# Altium schematic sheet MSP430_power_jtag.SchDoc: SVPXFMC Carrier 3U
size A4; CheckedBy: \; Author: G.Kasprowicz; CompanyName: ISE; DrawnBy: T.Przywozki; Organization: WUT ISE; Address1: Warsaw University of Technology; Address2: Nowowiejska 15/19 00-665 Warsaw; Revision: 1.0.; SheetNumber: 17; SheetTotal: 20; Project: SVPXFMC Carrier 3U; ModifiedBy: -; CheckedDate: -; Title2: MSP430 power and JTAG; DivGrp: ISE; Designer: G. Kasprowicz
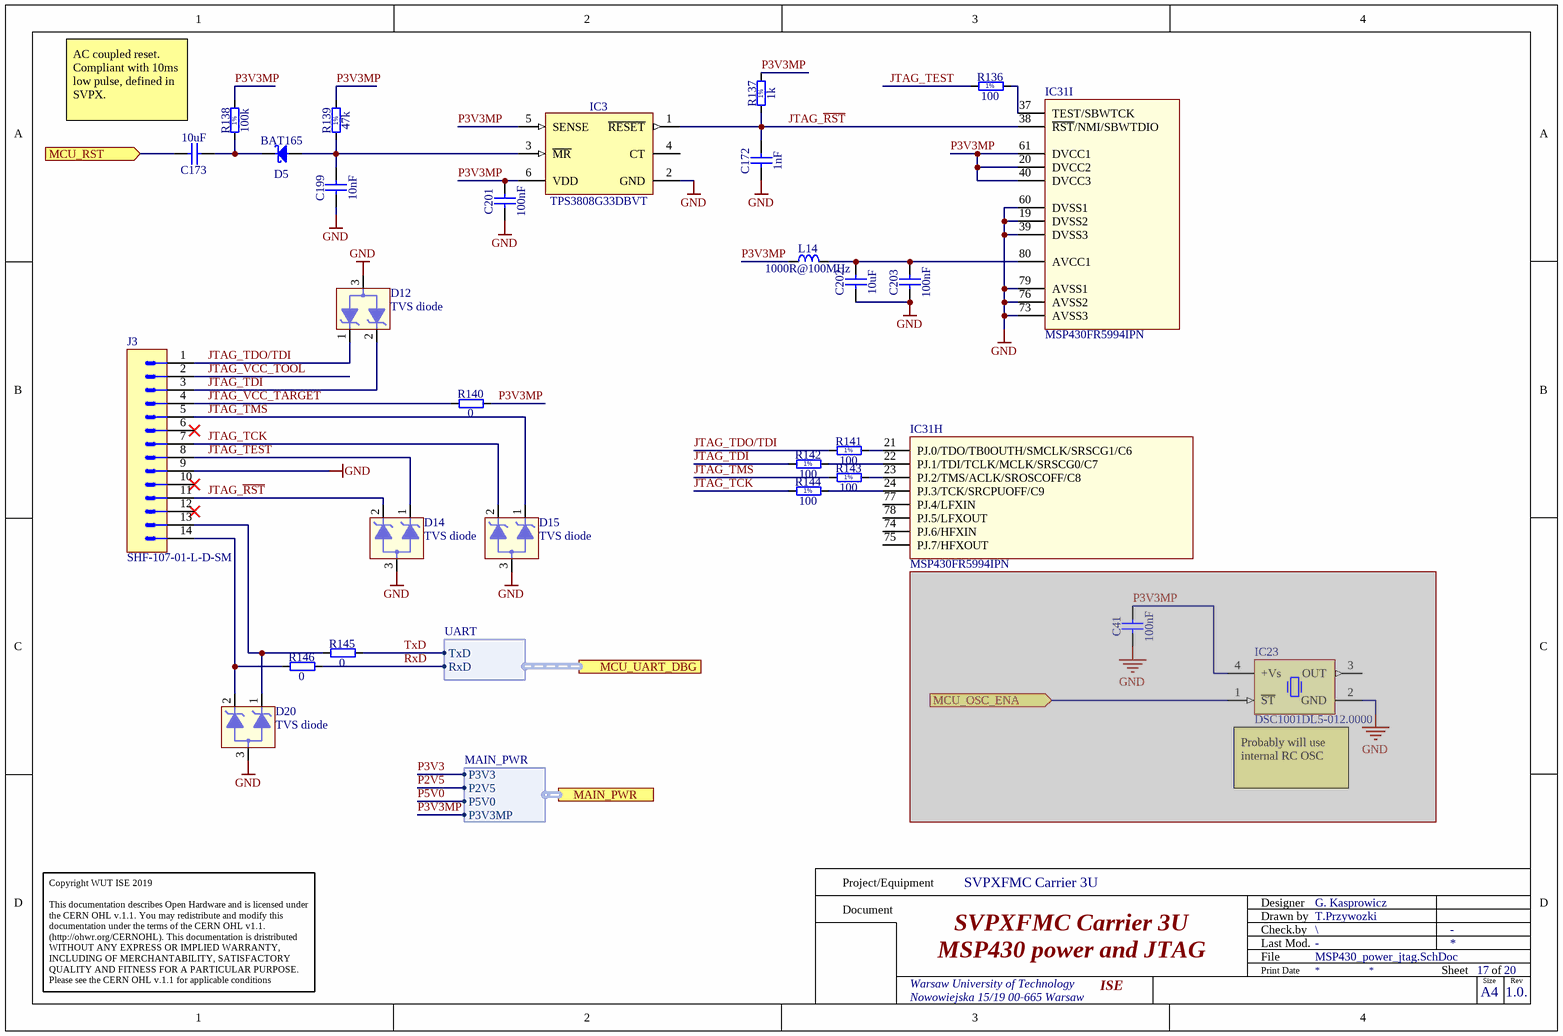
[diagram p0: MSP430_power_jtag.SchDoc]

## Parts
C41  100nF  [CAPC1005X55N]  (masked out: inside a compile mask, not in the netlist)
C172  1nF  [CAPC1005X55N]
C173  10uF  [CAPC1608X80N]
C199  10nF  [CAPC1005X55N]
C201  100nF  [CAPC1005X55N]
C202  10uF  [CAPC1608X80N]
C203  100nF  [CAPC1005X55N]
D5  BAT165  [SOD2512X110N]
D12  TVS diode  [SOTFL40P120X59-3N]
D14  TVS diode  [SOTFL40P120X59-3N]
D15  TVS diode  [SOTFL40P120X59-3N]
D20  TVS diode  [SOTFL40P120X59-3N]
IC3  TPS3808G33DBVT  [SOT95P280X145-6N]
IC23  DSC1001DL5-012.0000  [OSC_MICREL_2520]  (masked out: inside a compile mask, not in the netlist)
IC31  MSP430FR5994IPN  [QFP50P1400X1400X120-80N]  (parts H,I of 9)
J3  SHF-107-01-L-D-SM  [SHF-107-01-L-D-SM-LC]
L14  1000R@100MHz  [INDC1608X95N]
R136  100  [RESC1005X40N]
R137  1k  [RESC1005X40N]
R138  100k  [RESC1005X40N]
R139  47k  [RESC1005X40N]
R140  0  [RESC1608X55N]
R141  100  [RESC1005X40N]
R142  100  [RESC1005X40N]
R143  100  [RESC1005X40N]
R144  100  [RESC1005X40N]
R145  0  [RESC1608X55N]
R146  0  [RESC1608X55N]

## Ports
MAIN_PWR (harness MAIN_PWR), MCU_OSC_ENA (in), MCU_RST (in), MCU_UART_DBG (harness UART)

## Harnesses
UART: TxD, RxD
MAIN_PWR: P3V3, P2V5, P5V0, P3V3MP

## Nets
GND: C172.1 C199.1 C201.1 C202.1 C203.1 D12.3 D14.3 D15.3 D20.3 IC3.2(GND) IC31.19(DVSS2) IC31.39(DVSS3) IC31.60(DVSS1) IC31.73(AVSS3) IC31.76(AVSS2) IC31.79(AVSS1) J3.9
JTAG_~{RST}: C172.2 D14.2 IC3.1(~{RESET}) IC31.38(~{RST}/NMI/SBWTDIO) J3.11 R137.1
JTAG_TCK: D15.2 J3.7 R144.1
JTAG_TDI: D12.2 J3.3 R142.1
JTAG_TDO/TDI: D12.1 J3.1 R141.1
JTAG_TEST: D14.1 J3.8 R136.1
JTAG_TMS: D15.1 J3.5 R143.1
JTAG_VCC_TARGET: J3.4 R140.1
JTAG_VCC_TOOL: J3.2
MCU_RST: C173.2 ; port MCU_RST
P2V5: port MAIN_PWR.P2V5
P3V3: port MAIN_PWR.P3V3
P3V3MP: C201.2 IC3.5(SENSE) IC3.6(VDD) IC31.20(DVCC2) IC31.40(DVCC3) IC31.61(DVCC1) L14.1 R137.2 R138.2 R139.2 R140.2 ; port MAIN_PWR.P3V3MP
P5V0: port MAIN_PWR.P5V0
RxD: R146.2 ; port MCU_UART_DBG.RxD
TxD: R145.2 ; port MCU_UART_DBG.TxD
NetC173_1: C173.1 D5.1(C) R138.1
NetC199_2: C199.2 D5.2(A) IC3.3(~{MR}) R139.1
NetC202_2: C202.2 C203.2 IC31.80(AVCC1) L14.2
NetD20_1: D20.1 J3.13 R145.1
NetD20_2: D20.2 J3.14 R146.1
NetIC31_21: IC31.21(PJ.0/TDO/TB0OUTH/SMCLK/SRSCG1/C6) R141.2
NetIC31_22: IC31.22(PJ.1/TDI/TCLK/MCLK/SRSCG0/C7) R142.2
NetIC31_23: IC31.23(PJ.2/TMS/ACLK/SROSCOFF/C8) R143.2
NetIC31_24: IC31.24(PJ.3/TCK/SRCPUOFF/C9) R144.2
NetIC31_37: IC31.37(TEST/SBWTCK) R136.2

Not connected (* = marked no-connect by the designer): IC3 4(CT); IC31 74(PJ.6/HFXIN) 75(PJ.7/HFXOUT) 77(PJ.4/LFXIN) 78(PJ.5/LFXOUT); J3 6* 10* 12*

## Notes on the sheet
- AC coupled reset. Compliant with 10ms low pulse, defined in SVPX.
- (near J3) Verify JTAG connection. Documentation connects 1 pin of the connector to "TDI/TDO" pin uC.
  IO description does not contain a pin described as "TDI/TDO".
- (near IC23) Probably will use internal RC OSC
- Project/Equipment
- Document
- Designer
- Drawn by
- Check.by
- Copyright WUT ISE 2019
  This documentation describes Open Hardware and is licensed under the CERN OHL v.1.1. You may redistribute and modify this documentation under the terms of the CERN OHL v1.1.
  (http://ohwr.org/CERNOHL). This documentation is dristributed WITHOUT ANY EXPRESS OR IMPLIED WARRANTY, INCLUDING OF MERCHANTABILITY, SATISFACTORY QUALITY AND FITNESS FOR A PARTICULAR PURPOSE. Please see the CERN OHL v.1.1 for applicable conditions
- File
- Last Mod.
- Print Date
- Sheet
- Size
- A4
- of
- Rev
- (in symbol R0402_1K_1%_0.0625W_100PPM) 1%
- (in symbol R0402_47K_1%_0.0625W_100PPM) 1%
- (in symbol R0402_100K_1%_0.0625W_100PPM) 1%
- (in symbol R0402_100R_1%_0.0625W_100PPM) 1%

## Library data of the parts
C41 C201 C203 = CC0402_100NF_25V_10%_X7R_YUDEN_TMK105B7104KVHF: Non-polarised capacitor; Part Description: SMD Multilayer Chip Ceramic Capacitor (High Dielectric Type) for Automotive / Industrial Applications; Manufacturer: TAIYO YUDEN; Voltage: 25V; TC: X7R; Tolerance: ±10%; Part Number: CC0402_100NF_25V_10%_X7R_YUDEN_TMK105B7104KVHF; Component Kind: Standard; Component Type: Standard; Pin Count: 2; Value: 100nF; Status: Not Recommended; Manufacturer Part Number: TMK105B7104KVHF; Case: 0402; Mounted: Yes; Socket: No; SMD: Yes; Sense: No; HelpURL: \\cern.ch\dfs\Applications\Altium\Datasheets\CC0402_TAIYO-YUDEN_TMK105B7104KVHF.pdf; Author: CERN DEM JLC; CreateDate: 10.05.2017; LatestRevisionDate: 10.05.2017; ComponentHeight: 0.55mm
C172 = CC0402_1NF_50V_10%_X7R: Non-polarised capacitor; Part Description: SMD Multilayer Chip Ceramic Capacitor; Manufacturer: GENERIC; Manufacturer1 Part Number: 223858715623; Voltage: 50V; TC: X7R; Tolerance: ±10%; Part Number: CC0402_1NF_50V_10%_X7R; Component Kind: Standard; Component Type: Standard; Pin Count: 2; Value: 1nF; Status: Not Recommended; Manufacturer Part Number: CC0402_1NF_50V_10%_X7R; Case: 0402; Mounted: Yes; Socket: No; SMD: Yes; Sense: No; Manufacturer1 Example: PHYCOMP; Manufacturer1 ComponentHeight: 0.55mm; HelpURL: \\cern.ch\dfs\Applications\Altium\Datasheets\CC0402_X7R_PHYCOMP.pdf; Author: CERN DEM JLC; CreateDate: 03.12.2007; LatestRevisionDate: 03.12.2007
C173 C202 = CC0603_10UF_16V_20%_X5R: Non-polarised capacitor; Part Description: SMD Multilayer Chip Ceramic Capacitor; Manufacturer: GENERIC; Manufacturer1 Part Number: GRM188R61C106MA73D; Voltage: 16V; TC: X5R; Tolerance: ±20%; Part Number: CC0603_10UF_16V_20%_X5R; Component Kind: Standard; Component Type: Standard; Pin Count: 2; Value: 10uF; Status: None; Manufacturer Part Number: CC0603_10UF_16V_20%_X5R; Case: 0603; Mounted: Yes; Socket: No; SMD: Yes; Sense: No; Manufacturer1 Example: MURATA; Manufacturer1 ComponentHeight: 0.8mm; HelpURL: \\cern.ch\dfs\Applications\Altium\Datasheets\CC0603_X5R_MURATA_GRM.pdf; Author: CERN DEM MR; CreateDate: 2016-03-02; LatestRevisionDate: 2016-03-02
C199 = CC0402_10NF_50V_10%_X7R: Non-polarised capacitor; Part Description: SMD Multilayer Chip Ceramic Capacitor; Manufacturer: GENERIC; Manufacturer1 Part Number: GRM155R71H103KA88D; Voltage: 50V; TC: X7R; Tolerance: ±10%; Part Number: CC0402_10NF_50V_10%_X7R; Component Kind: Standard; Component Type: Standard; Pin Count: 2; Value: 10nF; Status: None; Manufacturer Part Number: CC0402_10NF_50V_10%_X7R; Case: 0402; Mounted: Yes; Socket: No; SMD: Yes; Sense: No; Manufacturer1 Example: MURATA; Manufacturer1 ComponentHeight: 0.55mm; HelpURL: \\cern.ch\dfs\Applications\Altium\Datasheets\CC0402_X7R_MURATA_GRM.pdf; Author: CERN DEM MR; CreateDate: 08.01.2016; LatestRevisionDate: 08.01.2016
D5 = BAT165: Schottky Diode; Part Description: Medium Power AF Schottky Diode; Manufacturer: INFINEON; Voltage: 40V; Power: 750mA; PressFit: No; Bonding: No; Part Number: BAT165; Component Kind: Standard; Component Type: Standard; Device: BAT165; PackageDescription: Small Outline Diode (SOD-323), 1.70mm W X 1.25mm L X 1.10mm H body,  IPC Medium Density; Manufacturer Part Number: BAT165; Pin Count: 2; Case: SOD323; Mounted: Yes; Socket: No; SMD: Yes; Sense: No; ComponentHeight: 1.1mm; HelpURL: \\cern.ch\dfs\Applications\Altium\Datasheets\BAT165.pdf; Author: CERN DEM JLC; CreateDate: 12.11.2014; LatestRevisionDate: 12.11.2014
D12 D14 D15 D20 = ESD7C3.3DT5G: Dual TVS diode, Vrwm=3.3V; Manufacturer: ON Semiconductor; Bonding: No; ComponentHeigth: 0.5mm; PressFit: No; Value: 3.3V; Case: SOT-723; Component Kind: Standard; Component Type: Standard; CreateDate: 2018-06-18; Device: TVS diode; HelpURL: https://www.onsemi.com/pub/Collateral/ESD7C3.3D-D.PDF; LatestRevisionDate: 2018-06-18; Manufacturer Part Number: ESD7C3.3DT5G; Mounted: Yes; PackageDescription: SOT-723; Part Description: TVS diode; Part Number: ESD7C3.3DT5G; Pin Count: 3; Sense: No; SMD: Yes; Socket: No
IC3 = TPS3808G33DBVT: Low Quiescent Current, Programmable-Delay Supervisory Circuit; Part Description: 3.3V, Low Quiescent Current, Programmable-Delay Supervisory Circuit; Manufacturer: TEXAS INSTRUMENTS; PressFit: No; Bonding: No; Part Number: TPS3808G33DBVT; Component Kind: Standard; Component Type: Standard; Device: TPS3808G33DBVT; PackageDescription: SOT23, 6-Leads, Body 1.6x3.0mm, Pitch 0.95mm, IPC Medium Density; Manufacturer Part Number: TPS3808G33DBVT; Pin Count: 6; Case: SOT23-6; Mounted: Yes; Socket: No; SMD: Yes; Sense: No; ComponentHeight: 1.45mm; Author: CERN DEM JLC; HelpURL: \\cern.ch\dfs\Applications\Altium\Datasheets\TPS3808G33DBVT.pdf; CreateDate: 05.11.2013; LatestRevisionDate: 05.11.2013
IC23 = DSC1001DL5-012.0000: MEMS Oscillator 12MHz; Manufacturer: Micrel; Bonding: No; PressFit: No; Case: *; Component Kind: Standard; Component Type: Standard; ComponentHeigth: *; CreateDate: 2018-05-21; Device: DSC1001DL5-012.0000; Footprint: MICREL SMD Oscillator, QFN, 4 pins, 2.5mm x 2.0mm; HelpURL: *; LatestRevisionDate: 2018-05-21; Manufacturer Part Number: DSC1001DL5-012.0000; Mounted: Yes; PackageDescription: MICREL SMD Oscillator, QFN, 4 pins, 2.5mm x 2.0mm; Part Description: MEMS Oscillator 12MHz; Part Number: DSC1001DL5-012.0000; Pin Count: 4; Sense: No; SMD: Yes; Socket: No; Value: *
IC31 = MSP430FR5994IPN: Manufacturer: TI; Part Description: FRAM microcontroller; Bonding: No; ComponentHeigth: 2mm; PressFit: No; Case: LQFP80; Component Kind: Standard; Component Type: Standard; CreateDate: 2018-01-01; Device: MSP430FR5994IPN; Footprint: LQFP80; HelpURL: *; LatestRevisionDate: 2018-01-01; Manufacturer Part Number: MSP430FR5994IPN; Mounted: Yes; PackageDescription: LQFP80; Part Number: MSP430FR5994IPN; Pin Count: 80; Sense: No; SMD: Yes; Socket: No; Value: *
J3 = SHF-107-01-L-D-SM: Header, 14 contacts, Pitch 1,27mm, Double Row, SMD; Manufacturer: Samtec; Part Description: Horizontal header, 14 contacts, Pitch 2.54mm, Double Row, SMD; Bonding: No; ComponentHeigth: 6.1mm; PressFit: No; Case: SHF-107-01-L-D-SM; Component Kind: Standard; Component Type: Standard; CreateDate: 2018-12-07; Device: SHF-107-01-L-D-SM; Footprint: SHF-107-01-L-D-SM; HelpURL: http://suddendocs.samtec.com/prints/shf-1xx-01-x-d-xx-xx-footprint.pdf; LatestRevisionDate: 2018-12-07; Manufacturer Part Number: SHF-107-01-L-D-SM; Mounted: Yes; Part Number: SHF-107-01-L-D-SM; Pin Count: 14; Sense: No; SMD: No; Socket: No; Value: *
L14 = IND0603_MURATA_BLM18HE102SN1: Inductor; Part Description: SMD EMIFIL Suppression Chip Ferrite Bead; Manufacturer: MURATA; Power: 600mA; Resistance: 0.35R; Tolerance: ±25%; Part Number: IND0603_MURATA_BLM18HE102SN1; Component Kind: Standard; Component Type: Standard; Pin Count: 2; Value: 1000R@100MHz; Status: None; Manufacturer Part Number: BLM18HE102SN1; Case: 0603; Mounted: Yes; Socket: No; SMD: Yes; Sense: No; ComponentHeight: 0.95mm; HelpURL: \\cern.ch\dfs\Applications\Altium\Datasheets\IND0603_MURATA_BLM18H.pdf; Author: CERN DEM JLC; CreateDate: 09/12/2013; LatestRevisionDate: 09/12/2013
R136 R141-R144 = R0402_100R_1%_0.0625W_100PPM: Resistor - 1%; Part Description: General Purpose Thick Film Chip Resistor; Manufacturer: GENERIC; Manufacturer1 Part Number: 232270671001L; TC: ±100ppm/°C; PressFit: No; Part Number: R0402_100R_1%_0.0625W_100PPM; Component Kind: Standard; Component Type: Standard; Pin Count: 2; Value: 100; Status: Not Recommended; Power: 0.0625W; Tolerance: ±1%; Manufacturer Part Number: R0402_100R_1%_0.0625W_100PPM; Case: 0402; Mounted: Yes; Sense: No; Socket: No; SMD: Yes; Manufacturer1 Example: YAGEO PHYCOMP; Manufacturer1 ComponentHeight: 0.4mm; HelpURL: \\cern.ch\dfs\Applications\Altium\Datasheets\R0402_Phycomp_RC0402.pdf; Author: CERN DEM JLC; CreateDate: 03.12.2007; LatestRevisionDate: 17.10.2012
R137 = R0402_1K_1%_0.0625W_100PPM: Resistor - 1%; Part Description: General Purpose Thick Film Chip Resistor; Manufacturer: GENERIC; Manufacturer1 Part Number: 232270671002L; TC: ±100ppm/°C; PressFit: No; Part Number: R0402_1K_1%_0.0625W_100PPM; Component Kind: Standard; Component Type: Standard; Pin Count: 2; Value: 1k; Status: Not Recommended; Power: 0.0625W; Tolerance: ±1%; Manufacturer Part Number: R0402_1K_1%_0.0625W_100PPM; Case: 0402; Mounted: Yes; Sense: No; Socket: No; SMD: Yes; Manufacturer1 Example: YAGEO PHYCOMP; Manufacturer1 ComponentHeight: 0.4mm; HelpURL: \\cern.ch\dfs\Applications\Altium\Datasheets\R0402_Phycomp_RC0402.pdf; Author: CERN DEM JLC; CreateDate: 03.12.2007; LatestRevisionDate: 17.10.2012
R138 = R0402_100K_1%_0.0625W_100PPM: Resistor - 1%; Part Description: General Purpose Thick Film Chip Resistor; Manufacturer: GENERIC; Manufacturer1 Part Number: 232270671004L; TC: ±100ppm/°C; PressFit: No; Part Number: R0402_100K_1%_0.0625W_100PPM; Component Kind: Standard; Component Type: Standard; Pin Count: 2; Value: 100k; Status: Not Recommended; Power: 0.0625W; Tolerance: ±1%; Manufacturer Part Number: R0402_100K_1%_0.0625W_100PPM; Case: 0402; Mounted: Yes; Sense: No; Socket: No; SMD: Yes; Manufacturer1 Example: YAGEO PHYCOMP; Manufacturer1 ComponentHeight: 0.4mm; HelpURL: \\cern.ch\dfs\Applications\Altium\Datasheets\R0402_Phycomp_RC0402.pdf; Author: CERN DEM JLC; CreateDate: 03.12.2007; LatestRevisionDate: 17.10.2012
R139 = R0402_47K_1%_0.0625W_100PPM: Resistor - 1%; Part Description: General Purpose Thick Film Chip Resistor; Manufacturer: GENERIC; Manufacturer1 Part Number: 232270675103L; TC: ±100ppm/°C; PressFit: No; Part Number: R0402_47K_1%_0.0625W_100PPM; Component Kind: Standard; Component Type: Standard; Pin Count: 2; Value: 47k; Status: Not Recommended; Power: 0.0625W; Tolerance: ±1%; Manufacturer Part Number: R0402_47K_1%_0.0625W_100PPM; Case: 0402; Mounted: Yes; Sense: No; Socket: No; SMD: Yes; Manufacturer1 Example: YAGEO PHYCOMP; Manufacturer1 ComponentHeight: 0.4mm; HelpURL: \\cern.ch\dfs\Applications\Altium\Datasheets\R0402_Phycomp_RC0402.pdf; Author: CERN DEM JLC; CreateDate: 03.12.2007; LatestRevisionDate: 17.10.2012
R140 R145 R146 = R0603_0R_JUMPER: Resistor; Part Description: 1A (0.05R Max DC Resistance) Zero Ohm Jumper; Manufacturer: GENERIC; Manufacturer1 Part Number: NRC06Z0; PressFit: No; Part Number: R0603_0R_JUMPER; Component Kind: Standard; Component Type: Standard; Pin Count: 2; Value: 0; Status: Preferred; Manufacturer Part Number: R0603_0R_JUMPER; Case: 0603; Mounted: Yes; Sense: No; Socket: No; SMD: Yes; Manufacturer1 Example: NIC COMPONENT; Manufacturer1 ComponentHeight: 0.55mm; HelpURL: \\cern.ch\dfs\Applications\Altium\Datasheets\R0603_NIC_NRC.pdf; Author: CERN DEM JLC; CreateDate: 03.12.2007; LatestRevisionDate: 13.03.2008